# Altium project Copy of MB1248.PrjPCB (part 2 of 3)

## Sheet Audio.SchDoc: Audio
size A4; Project: STM32H7-DK; Date: Not used; ApprovedBy: Not used; CheckedBy: Not used; Author: Not used; CompanyName: STMicroelectronics; DrawnBy: Not used; Engineer: Not used; Organization: Not used; Address1: Not used; Address2: Not used; Address3: Not used; Address4: Not used; DocumentNumber: Not used; Revision: Not used; SheetNumber: 6; SheetTotal: 16; CurrentTime: Not used; CurrentDate: Not used; Time: Not used; DocumentFullPathAndName: Not used; DocumentName: Not used; ModifiedDate: Not used; ImagePath: Not used; ProjectName: Not used; Application_BuildNumber: Not used
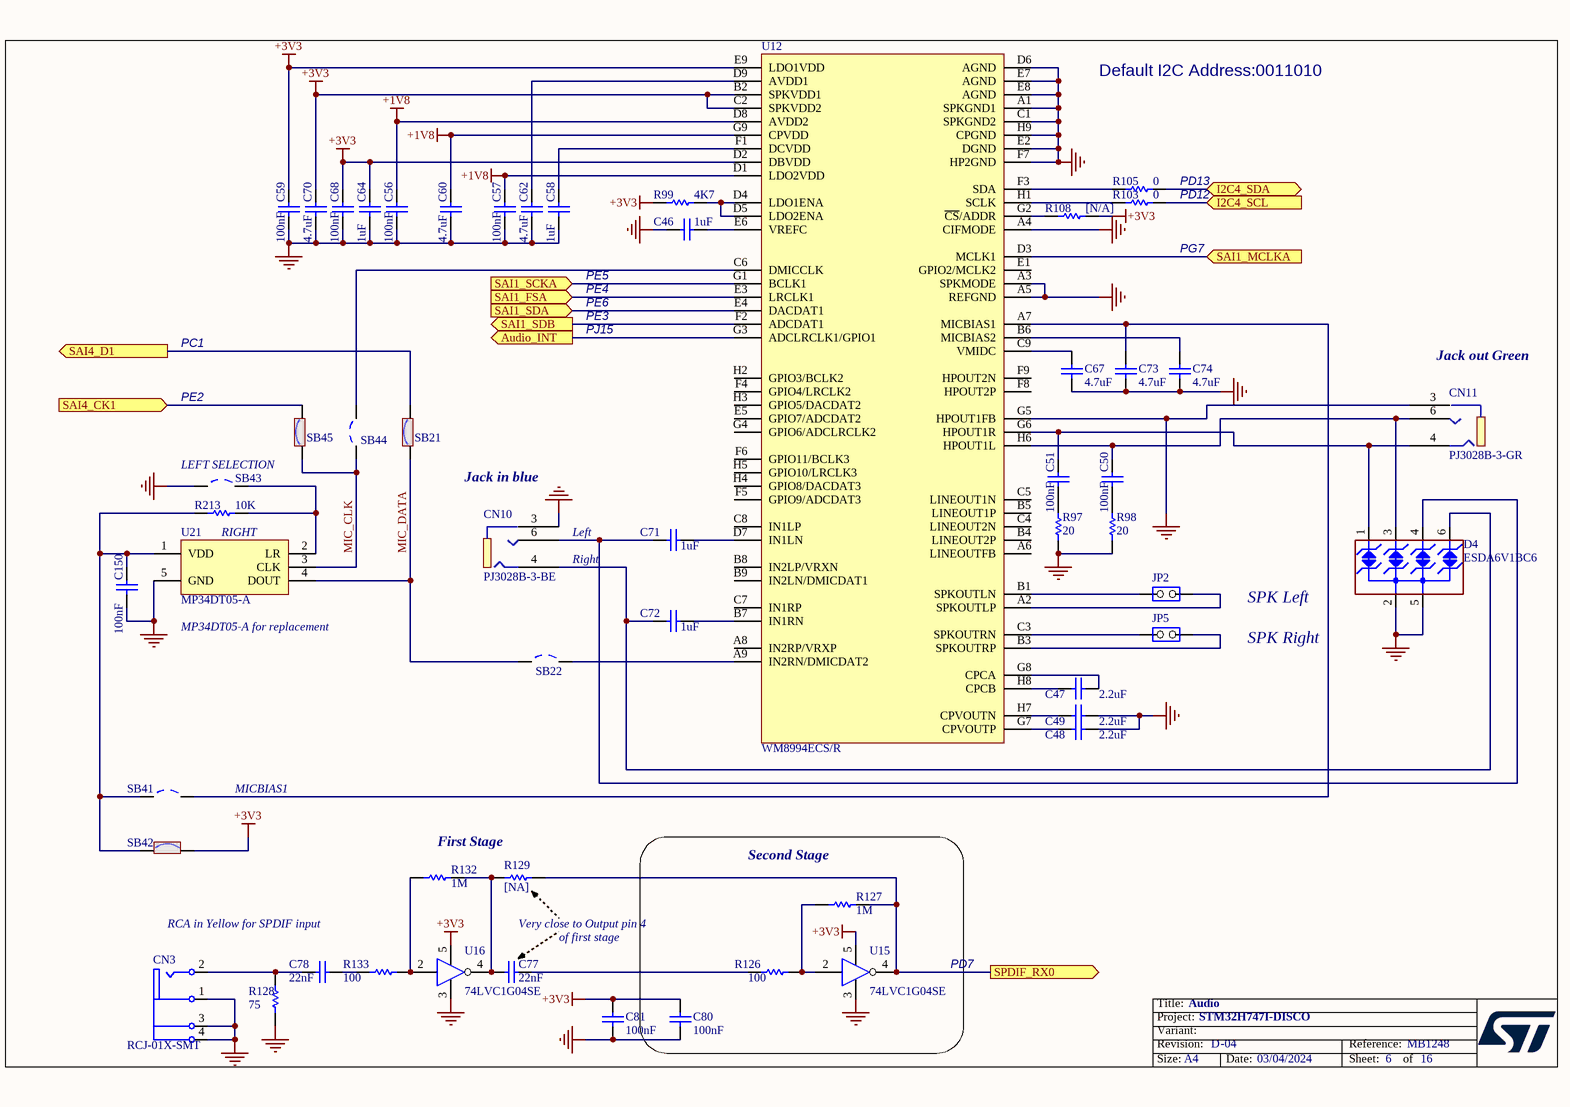
[diagram p5: Audio.SchDoc]

### Parts
C46  1uF  [0603C]
C47  2.2uF  [0603C]
C48  2.2uF  [0603C]
C49  2.2uF  [0603C]
C50  100nF  [0603C]
C51  100nF  [0603C]
C56  100nF  [0603C]
C57  100nF  [0603C]
C58  1uF  [0603C]
C59  100nF  [0603C]
C60  4.7uF  [0603C]
C62  4.7uF  [0603C]
C64  1uF  [0603C]
C67  4.7uF  [0603C]
C68  100nF  [0603C]
C70  4.7uF  [0603C]
C71  1uF  [0603C]
C72  1uF  [0603C]
C73  4.7uF  [0603C]
C74  4.7uF  [0603C]
C77  22nF  [0603C]
C78  22nF  [0603C]
C80  100nF  [0603C]
C81  100nF  [0603C]
C150  100nF  [0603C]
CN3  RCJ-01X-SMT  [RCA_3SM_1TH_14X15]
CN10  PJ3028B-3-BE  [PJ3028B]
CN11  PJ3028B-3-GR  [PJ3028B]
D4  ESDA6V1BC6  [SOT23-6L]
JP2  (no value)  [SIP2]
JP5  (no value)  [SIP2]
R97  20  [0603R]
R98  20  [0603R]
R99  4K7  [0603R]
R103  0  [0603R]
R105  0  [0603R]
R108  [N/A]  [0603R]
R126  100  [0603R]
R127  1M  [0603R]
R128  75  [0603R]
R129  [NA]  [0603R]
R132  1M  [0603R]
R133  100  [0603R]
R213  10K  [0603R]
SB21  Solder Bridge ON  [SB_0603]  (value not drawn)
SB22  Solder Bridge OFF  [SB_0603]  (value not drawn)
SB41  Solder Bridge OFF  [SB_0603]  (value not drawn)
SB42  Solder Bridge ON  [SB_0603]  (value not drawn)
SB43  Solder Bridge OFF  [SB_0603]  (value not drawn)
SB44  Solder Bridge OFF  [SB_0603]  (value not drawn)
SB45  Solder Bridge ON  [SB_0603]  (value not drawn)
U12  WM8994ECS/R  [BGA72_0R5_4R5X4]
U15  74LVC1G04SE  [SOT-353]
U16  74LVC1G04SE  [SOT-353]
U21  MP34DT05-A  [MP34DT01TR]

### Blocks framed on the sheet
Second Stage: C80 R126 R127 U15

### Ports
Audio_INT (out), I2C4_SCL (in), I2C4_SDA (bidir), SAI1_FSA (in), SAI1_MCLKA (in), SAI1_SCKA (in), SAI1_SDA (in), SAI1_SDB (out), SAI4_CK1 (in), SAI4_D1 (out), SPDIF_RX0 (out)

### Nets
+1V8: C56.1 C57.1 C60.1 U12.D1(LDO2VDD) U12.D8(AVDD2) U12.G9(CPVDD)
+3V3: C59.1 C64.1 C68.1 C70.1 C80.2 C81.2 R99.2 R108.2 SB42.2 U12.B2(SPKVDD1) U12.C2(SPKVDD2) U12.D2(DBVDD) U12.E9(LDO1VDD) U15.5(VCC) U16.5(VCC)
GND: C46.2 C48.2 C49.2 C56.2 C57.2 C58.2 C59.2 C60.2 C62.2 C64.2 C67.1 C68.2 C70.2 C73.1 C74.1 C80.1 C81.1 C150.2 CN3.1(Ground) CN3.3(Ground) CN3.4(Ground) CN10.3 CN11.3 D4.2(IO2) D4.5(IO4) R97.2 R98.2 R128.1 SB43.1 U12.A1(SPKGND1) U12.A3(SPKMODE) U12.A4(CIFMODE) U12.A5(REFGND) U12.C1(SPKGND2) U12.D6(AGND) U12.E2(DGND) U12.E7(AGND) U12.E8(AGND) U12.F7(HP2GND) U12.G5(HPOUT1FB) U12.H9(CPGND) U15.3(GND) U16.3(GND) U21.5(GND)
MIC_CLK: SB44.1 SB45.1 U21.3(CLK)
MIC_DATA: SB21.1 SB22.1 U21.4(DOUT)
PC1: SB21.2 ; port SAI4_D1
PD7: R127.2 R129.2 U15.4(Y) ; port SPDIF_RX0
PD12: R103.1 ; port I2C4_SCL
PD13: R105.1 ; port I2C4_SDA
PE3: U12.F2(ADCDAT1) ; port SAI1_SDB
PE4: U12.E3(LRCLK1) ; port SAI1_FSA
PE5: U12.G1(BCLK1) ; port SAI1_SCKA
PE6: U12.E4(DACDAT1) ; port SAI1_SDA
PG7: U12.D3(MCLK1) ; port SAI1_MCLKA
PJ15: U12.G3(ADCLRCLK1/GPIO1) ; port Audio_INT
NetC46_1: C46.1 U12.E6(VREFC)
NetC47_1: C47.1 U12.H8(CPCB)
NetC47_2: C47.2 U12.G8(CPCA)
NetC48_1: C48.1 U12.G7(CPVOUTP)
NetC49_1: C49.1 U12.H7(CPVOUTN)
NetC50_1: C50.1 CN11.6 D4.3(GND) U12.H6(HPOUT1L)
NetC50_2: C50.2 R98.1
NetC51_1: C51.1 CN11.4 D4.1(IO1) U12.G6(HPOUT1R)
NetC51_2: C51.2 R97.1
NetC58_1: C58.1 U12.F1(DCVDD)
NetC62_1: C62.1 U12.D9(AVDD1)
NetC67_2: C67.2 U12.C9(VMIDC)
NetC71_1: C71.1 U12.D7(IN1LN)
NetC71_2: C71.2 CN10.6 D4.4(IO3)
NetC72_1: C72.1 U12.B7(IN1RN)
NetC72_2: C72.2 CN10.4 D4.6(NC)
NetC73_2: C73.2 SB41.2 U12.A7(MICBIAS1)
NetC74_2: C74.2 U12.B6(MICBIAS2)
NetC77_1: C77.1 R129.1 R132.2 U16.4(Y)
NetC77_2: C77.2 R126.1
NetC78_1: C78.1 CN3.2(Signal) R128.2
NetC78_2: C78.2 R133.1
NetC150_1: C150.1 R213.2 SB41.1 SB42.1 U21.1(VDD)
NetJP2_1: JP2.1(COMMON) U12.A2(SPKOUTLP)
NetJP2_2: JP2.2(NO) U12.B1(SPKOUTLN)
NetJP5_1: JP5.1(COMMON) U12.B3(SPKOUTRP)
NetJP5_2: JP5.2(NO) U12.C3(SPKOUTRN)
NetR87_1: SB45.2 ; port SAI4_CK1
NetR99_1: R99.1 U12.D4(LDO1ENA) U12.D5(LDO2ENA)
NetR103_2: R103.2 U12.H1(SCLK)
NetR105_2: R105.2 U12.F3(SDA)
NetR108_1: R108.1 U12.G2(~{CS}/ADDR)
NetR126_2: R126.2 R127.1 U15.2(A)
NetR132_1: R132.1 R133.2 U16.2(A)
NetR213_1: R213.1 SB43.2 U21.2(LR)
NetSB22_2: SB22.2 U12.A9(IN2RN/DMICDAT2)
NetSB44_2: SB44.2 U12.C6(DMICCLK)

Not connected (* = marked no-connect by the designer): U12 A6(LINEOUTFB) A8(IN2RP/VRXP) B4(LINEOUT2P) B5(LINEOUT1P) B8(IN2LP/VRXN) B9(IN2LN/DMICDAT1) C4(LINEOUT2N) C5(LINEOUT1N) C7(IN1RP) C8(IN1LP) E1(GPIO2/MCLK2) E5(GPIO7/ADCDAT2) F4(GPIO4/LRCLK2) F5(GPIO9/ADCDAT3) F6(GPIO11/BCLK3) F8(HPOUT2P) F9(HPOUT2N) G4(GPIO6/ADCLRCLK2) H2(GPIO3/BCLK2) H3(GPIO5/DACDAT2) H4(GPIO8/DACDAT3) H5(GPIO10/LRCLK3); U15 1(NC); U16 1(NC)

### Notes on the sheet
- Default I2C Address:0011010
- PD13
- PD12
- PE5
- PG7
- PC1
- PE6
- PE4
- PE3
- PJ15
- PE2
- (near CN11) Jack out Green
- (near SB43) LEFT SELECTION
- Jack in blue
- RIGHT
- Left
- Right
- SPK Left
- MP34DT05-A for replacement
- SPK Right
- MICBIAS1
- First Stage
- RCA in Yellow for SPDIF input
- Very close to Output pin 4
- of first stage
- PD7
- Title:
- Project:
- Size:
- Revision:
- Variant:
- A4
- -
- Date:
- Reference:
- Sheet:
- of

### Library data of the parts
C46-C49 C58 C64 = CAP: Capacitor; Value: 100nF; Published: 8-Jun-2000; Revision: July-2002: Re-released for DXP Platform.; Publisher: Altium Limited
C50 C51 C56 C57 C59 C60 C62 C67 C68 C70 C73 C74 C150 = Cap: Capacitor; Value: 10nF; Published: 8-Jun-2000; Revision: July-2002: Re-released for DXP Platform.; Publisher: Altium Limited
C71 C72 = Cap_1uF_X5R_10%_0603: Capacitor,1uF,16V,X5R,10%,0603,YAGEO; Manuf_Part_1: CC0603KRX5R7BB105; Revision: July-2002: Re-released for DXP Platform.; Value: 1uF; Order: CC0603KRX5R7BB105; Manuf_1: YAGEO; ECCN_US/EU: n/a
C77 C78 = Cap_22nF_X7R_10%_0402: Capacitor,22nF,16V,X7R,10%,0402,YAGEO; Revision: July-2002: Re-released for DXP Platform.; Value: 22nF; Manuf_1: YAGEO; ECCN_US/EU: n/a
C80 C81 = CAP: Capacitor; Published: 8-Jun-2000; Revision: July-2002: Re-released for DXP Platform.; Publisher: Altium Limited; Value: 100nF
CN3 = RCA_SMD: RCA Phono Jack, Right Angle, SMD, Yellow; Manuf_Part_1: JBB0819100002; Manuf_1: JIUBABA; Manuf_2: CUI Inc; Manuf_Part_2: RCJ-014-SMT; Distrib: Sub Co
CN10 = PJ3028B-3-TR: Connector Jack Stereo 3.5mm, female SMT, Blue (Line input); Manuf_Part_1: PJ3028B-3_BE; Manuf_Part_2: PJ30280-3_BE; ECCN_US/EU: n/a; Manuf_1: http://ww.qiaod.com
CN11 = PJ3028B-3-TR: Connector Jack Stereo 3.5mm, female SMT, Green (Line input); Manuf_Part_1: PJ3028B-3_GR; Manuf_Part_2: PJ30280-3_GR; ECCN_US/EU: n/a; Manuf_1: http://ww.qiaod.com
D4 = ESDA6V1BC6: 4-line ESD protection; Manuf_1: STM; Ref St: 9179034; Fitted: YES; ECCN_US/EU: EAR99/NEC; Manuf_Part_1: ESDA6V1BC6; Distrib: ST; Order: ESDA6V1BC6; Ordered by: STM
JP2 JP5 = JP2
R97-R99 R103 R105 R213 = Res1: Resistor; Value: 1K; Published: 8-Jun-2000; Revision: July-2002: Re-released for DXP Platform.; Publisher: Altium Limited
R108 = res1: Resistor; Value: 1K; Ordered by: Subcon; ECCN_US/EU: NA; Fitted: NO; Published: 8-Jun-2000; Revision: July-2002: Re-released for DXP Platform.; Publisher: Altium Limited
R126 = Res_100_1%_0402: Resistor,100,0402,1%,YAGEO; Value: 100; Manuf_1: YAGEO; ECCN_US/EU: n/a; Distrib: FARNELL
R127 R132 = res1: Resistor, 1M , 0603; Ordered by: Subcon; ECCN_US/EU: NA; Published: 8-Jun-2000; Revision: July-2002: Re-released for DXP Platform.; Publisher: Altium Limited; Value: 1M
R128 = Res_75_1%_0402: Resistor,75,0402,1%,YAGEO; Order: 311-75.0LRTR-ND; Value: 75; Manuf_1: YAGEO; ECCN_US/EU: n/a; Distrib: DIGIKEY
R129 = Res_NA_0402: Resistor,[NA],0402; Fitted: NO; Value: [NA]; ECCN_US/EU: n/a
R133 = Res_100_1%_0402: Resistor,100,0402,1%,YAGEO; Order: 9239111; Value: 100; Manuf_1: YAGEO; ECCN_US/EU: n/a; Distrib: FARNELL
SB21 SB42 SB45 = SB_ON: Fitted: YES; Ordered by: Subcon; Revision: July-2002: Re-released for DXP Platform.; ECCN_US/EU: n/a
SB22 SB41 SB43 SB44 = SB_OFF: Fitted: NO; Ordered by: Subcon; Revision: July-2002: Re-released for DXP Platform.; ECCN_US/EU: n/a
U12 = WM8994ECS/R: Manuf_1: Wolfson; Ordered by: Subcon; ECCN_US/EU: EAR99/NEC; Fitted: YES; Manuf_Part_1: WM8994ECS/R
U15 U16 = 74LVC1G04SE: Single inverter gate with a standard push-pull output. (1.65V to 5.5V); Manuf_Part_1: 74LVC1G04SE-7; Manuf_1: DIODES; Ordered by: Subcon; Fitted: YES; ECCN_US/EU: EAR99/NEC; Distrib: FARNELL
U21 = MP34DT01TR: MEMS audio sensor; Ordered by: STM; ECCN_US/EU: EAR99/NEC; Fitted: YES; Revision: 17-Jul-2002: Re-released for DXP Platform.; Publisher: Altium Limited; Manuf_1: STM; Manuf_Part_1: MP34DT05-A

## Sheet Ethernet.SchDoc: Ethernet
size A4; Project: STM32H7-DK; Date: Not used; ApprovedBy: Not used; CheckedBy: Not used; Author: Not used; CompanyName: STMicroelectronics; DrawnBy: Not used; Engineer: Not used; Organization: Not used; Address1: Not used; Address2: Not used; Address3: Not used; Address4: Not used; DocumentNumber: Not used; Revision: Not used; SheetNumber: 8; SheetTotal: 16; CurrentTime: Not used; CurrentDate: Not used; Time: Not used; DocumentFullPathAndName: Not used; DocumentName: Not used; ModifiedDate: Not used; ImagePath: Not used; ProjectName: Not used; Application_BuildNumber: Not used
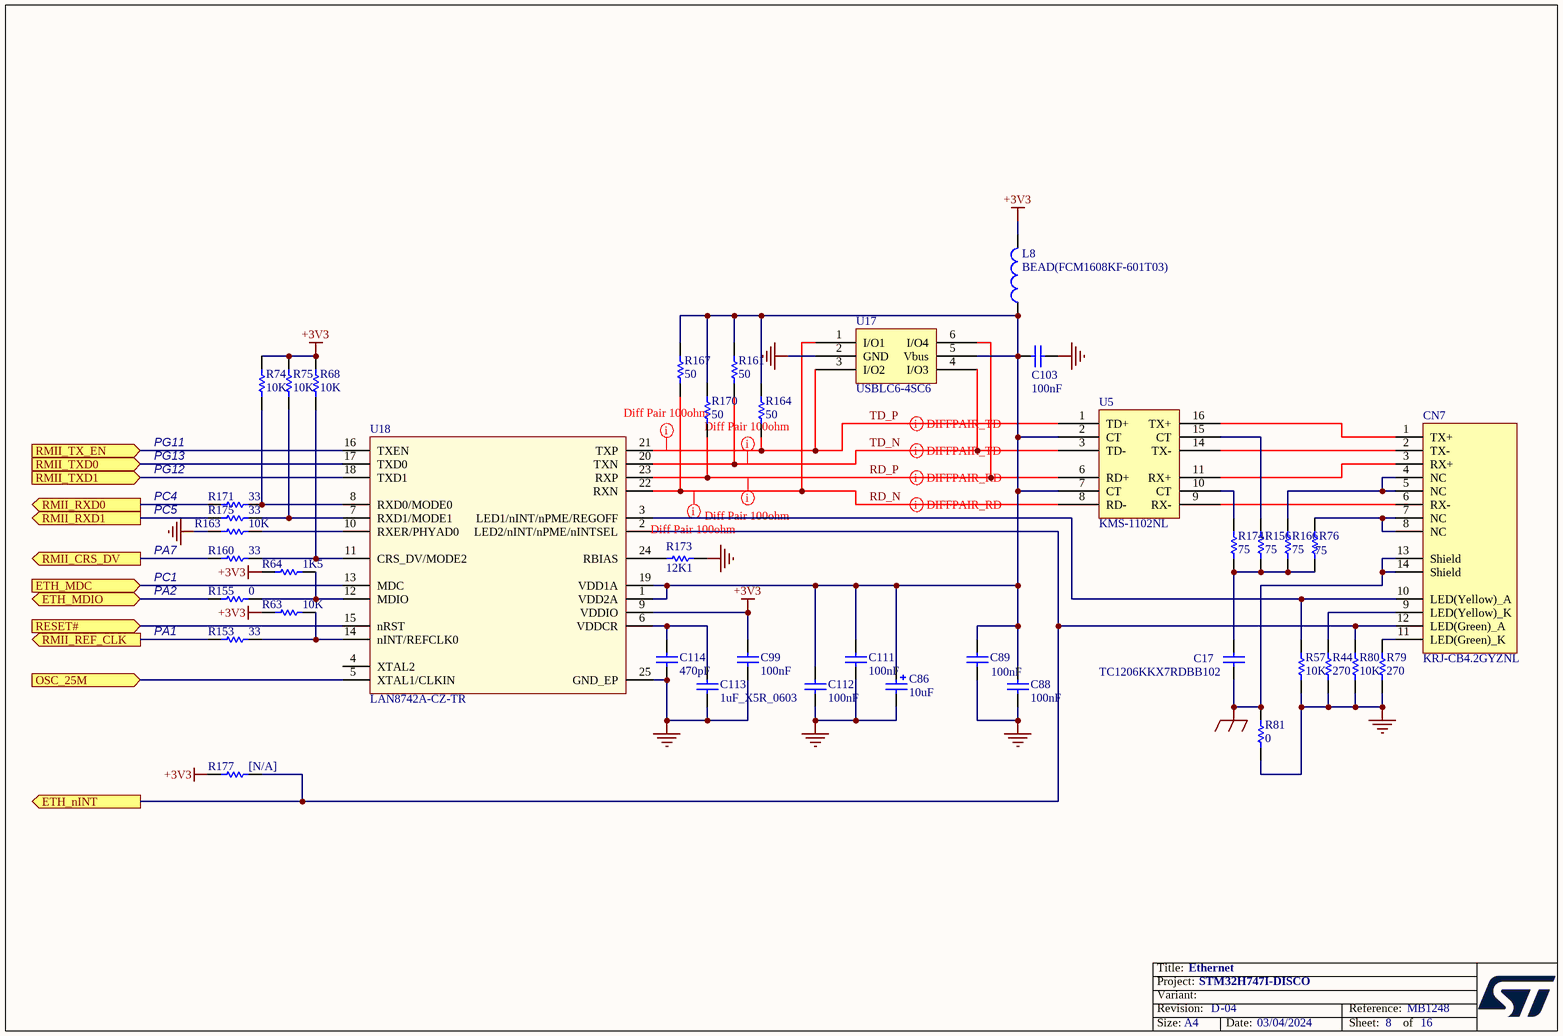
[diagram p6: Ethernet.SchDoc]

### Parts
C17  TC1206KKX7RDBB102  [1206C]
C86  10uF  [TAN-A]
C88  100nF  [0603C]
C89  100nF  [0603C]
C99  100nF  [0603C]
C103  100nF  [0603C]
C111  100nF  [0603C]
C112  100nF  [0603C]
C113  1uF_X5R_0603  [0603C]
C114  470pF  [0603C]
CN7  KRJ-CB4.2GYZNL  [RJ45_LED_KRJ-CB4R2GYZNL_EM]
L8  BEAD(FCM1608KF-601T03)  [0603L]
R44  270  [0603R]
R57  10K  [0603R]
R63  10K  [0603R]
R64  1K5  [0603R]
R68  10K  [0603R]
R74  10K  [0603R]
R75  10K  [0603R]
R76  75  [0603R]
R79  270  [0603R]
R80  10K  [0603R]
R81  0  [0805R]
R153  33  [0603R]
R155  0  [0603R]
R156  75  [0603R]
R160  33  [0603R]
R161  50  [0603R]
R163  10K  [0603R]
R164  50  [0603R]
R166  75  [0603R]
R167  50  [0603R]
R170  50  [0603R]
R171  33  [0603R]
R173  12K1  [0603R]
R174  75  [0603R]
R175  33  [0603R]
R177  [N/A]  [0603R]
U5  KMS-1102NL  [TF_16SM_12R7X9R65]
U17  USBLC6-4SC6  [SOT23-6]
U18  LAN8742A-CZ-TR  [QFN24_0R5_4X4]

### Ports
ETH_MDC (in), ETH_MDIO (bidir), ETH_nINT (out), OSC_25M (in), RESET# (in), RMII_CRS_DV (out), RMII_REF_CLK (out), RMII_RXD0 (out), RMII_RXD1 (out), RMII_TX_EN (in), RMII_TXD0 (in), RMII_TXD1 (in)

### Nets
+3V3: C99.2 L8.2 R63.1 R64.2 R68.1 R74.1 R75.1 R177.1 U18.9(VDDIO)
EGND: C17.1 CN7.13(Shield) CN7.14(Shield) R81.1
GND: C86.2 C88.1 C89.1 C99.1 C103.1 C111.1 C112.1 C113.2 C114.1 R44.2 R57.2 R79.2 R80.2 R81.2 R163.2 R173.2 U17.2(GND) U18.25(GND_EP)
PA1: R153.2 ; port RMII_REF_CLK
PA2: R155.2 ; port ETH_MDIO
PA7: R160.2 ; port RMII_CRS_DV
PC4: R171.2 ; port RMII_RXD0
PC5: R175.2 ; port RMII_RXD1
PG11: U18.16(TXEN) ; port RMII_TX_EN
PG12: U18.18(TXD1) ; port RMII_TXD1
PG13: U18.17(TXD0) ; port RMII_TXD0
RD_N: R167.1 U5.8(RD-) U17.1(I/O1) U18.22(RXN)
RD_P: R170.1 U5.6(RD+) U17.6(I/O4) U18.23(RXP)
TD_N: R161.1 U5.3(TD-) U17.4(I/O3) U18.20(TXN)
TD_P: R164.1 U5.1(TD+) U17.3(I/O2) U18.21(TXP)
NetB1_2: U18.15(nRST) ; port RESET#
NetC17_2: C17.2 R76.1 R156.1 R166.1 R174.1
NetC86_1: C86.1 C88.2 C89.2 C103.2 C111.2 C112.2 L8.1 R161.2 R164.2 R167.2 R170.2 U5.2(CT) U5.7(CT) U17.5(Vbus) U18.1(VDD2A) U18.19(VDD1A)
NetC113_1: C113.1 C114.2 U18.6(VDDCR)
NetCN7_1: CN7.1(TX+) U5.16(TX+)
NetCN7_2: CN7.2(TX-) U5.14(TX-)
NetCN7_3: CN7.3(RX+) U5.11(RX+)
NetCN7_4: CN7.4(NC) CN7.5(NC) R166.2
NetCN7_6: CN7.6(RX-) U5.9(RX-)
NetCN7_7: CN7.7(NC) CN7.8(NC) R76.2
NetCN7_9: CN7.9(LED(Yellow)_K) R44.1
NetCN7_10: CN7.10(LED(Yellow)_A) R57.1 U18.3(LED1/nINT/nPME/REGOFF)
NetCN7_11: CN7.11(LED(Green)_K) R79.1
NetCN7_12: CN7.12(LED(Green)_A) R80.1 R177.2 U18.2(LED2/nINT/nPME/nINTSEL) ; port ETH_nINT
NetR63_2: R63.2 R153.1 U18.14(nINT/REFCLK0)
NetR64_1: R64.1 R155.1 U18.12(MDIO)
NetR68_2: R68.2 R160.1 U18.11(CRS_DV/MODE2)
NetR72_2: U18.5(XTAL1/CLKIN) ; port OSC_25M
NetR74_2: R74.2 R171.1 U18.8(RXD0/MODE0)
NetR75_2: R75.2 R175.1 U18.7(RXD1/MODE1)
NetR156_2: R156.2 U5.15(CT)
NetR163_1: R163.1 U18.10(RXER/PHYAD0)
NetR173_1: R173.1 U18.24(RBIAS)
NetR174_2: R174.2 U5.10(CT)
NetSB8_1: U18.13(MDC) ; port ETH_MDC

Not connected (* = marked no-connect by the designer): U18 4(XTAL2)

### Layout directives
differential pair: RD_N, RD_P, TD_N, TD_P
rule Matched Net Lengths [Tolerance = 100mil]: RD_N, RD_P, TD_N, TD_P

### Notes on the sheet
- PG11
- PG13
- PG12
- PC4
- PC5
- PA7
- PC1
- PA2
- PA1
- Title:
- Project:
- Size:
- Revision:
- Variant:
- A4
- -
- Date:
- Reference:
- Sheet:
- of

### Library data of the parts
C17 = Capacitor_ST: Capacitor 0402 / 0603 / 0805/ 1206; Value: 100nF; Revision: July-2002: Re-released for DXP Platform.
C86 = Cap_10uF_POL_10%_TANA: Polarized Capacitor,10uF,10V,10%,typeA,VISHAY; Manuf_Part_1: 293D106X9010A2TE3; Revision: July-2002: Re-released for DXP Platform.; Value: 10uF; Manuf_1: VISHAY; Order: *; ECCN_US/EU: n/a
C88 C89 C99 C103 C111 C112 = Capacitor_ST: Capacitor 0402 / 0603 / 0805; Revision: July-2002: Re-released for DXP Platform.; Value: 100nF
C113 = CAP SMD 0603  X5R 1礔 25V 10%: 0603  X5R 1礔; Rated voltage: 25V; Tolerance: 10%; Manufacturer: *; Manufacturer P/N: *; Order code Farnell: 1288202RL; Value: 1礔; Power: *; Technology: X5R; Temperature  Factor: *; Temperature Max: +125癈; Temperature Min: -55癈; STS Code: *
C114 = Capacitor_ST: Capacitor 0402 / 0603 / 0805; Value: 100nF; Revision: July-2002: Re-released for DXP Platform.
CN7 = KRJ-CB4.2GYZNL: 100 Base-TX (Fast Ethernet) SMD RJ45 single port (1x1) with LEDS Integrated Magnetics Connector; Manuf_1: DGKYD; ECCN_US/EU: EAR99/NEC; Ordered by: Subcon; Fitted: YES; Manuf_Part_1: KRJ-CB4.2GYZNL
L8 = Inductor: Value: 100uH; Published: 8-Jun-2000; Revision: July-2002: Re-released for DXP Platform.; Publisher: Altium Limited
R44 R79 = Resistor_ST: Resistor 0402 / 0603 / 0805; Value: 10K
R57 R63 R68 R74 R75 R80 R163 = Resistor_ST: Resistor 0402 / 0603 / 0805; Value: 10K
R64 = Res_1K5_1%_0402: Resistor,1K5,0402,1%,YAGEO; Value: 1K5; Manuf_1: YAGEO; ECCN_US/EU: n/a; Distrib: FARNELL
R76 R81 R156 R166 R174 = Res_75_1%_0603: Resistor,75,0603,1%,YAGEO; Manuf_1: YAGEO; Order: *; ECCN_US/EU: n/a; Distrib: FARNELL
  R76 R156 R166 R174: Value: 75
  R81: Value: 0
R153 R160 R171 R175 = Res_33_1%_0402: Resistor,33,0402,1%,YAGEO; Value: 33; Manuf_1: YAGEO; Order: *; ECCN_US/EU: n/a; Distrib: FARNELL
R155 = Res1: Resistor; Value: 1K; Published: 8-Jun-2000; Revision: July-2002: Re-released for DXP Platform.; Publisher: Altium Limited
R161 R164 R167 R170 = Res_50_1%_0603: Resistor,50,0603,1%,YAGEO; Value: 50; Manuf_1: YAGEO; Order: *; ECCN_US/EU: n/a; Distrib: FARNELL
R173 = Res_12K1_1%_0603: Resistor,12K1,0603,1%,VISHAY; Manuf_Part_1: MCT 0603-50 1% P5 12K1; Order: 2325243; Value: 12K1; ECCN_US/EU: n/a; Manuf_1: VISHAY; Distrib: FARNELL
R177 = res1: as R108 on sheet Audio; Published: 8-Jun-2000; Revision: July-2002: Re-released for DXP Platform.; Publisher: Altium Limited
U5 = KMS-1102NL: Manuf_1: DGKYD; Fitted: YES; Ordered by: Subcon; ECCN_US/EU: NA; Manuf_Part_1: KMS-1102NL
U17 = USBLC6-4SC6: Fitted: YES; Ordered by: STM; ECCN_US/EU: EAR99/NEC; Manuf_1: STM; Manuf_Part_1: USBLC6-4SC6
U18 = LAN8742A-CZ-TR: LAN8742A-CZ-TR - Small Footprint RMII 10/100 Ethernet, Transceiver with HP Auto-MDIX and flexPWR Technology SQFN-24; Manuf_1: MICROCHIP; Ordered by: Subcon; Fitted: YES; ECCN_US/EU: EAR99/NEC; Manuf_Part_1: LAN8742A-CZ-TR

## Sheet Peripherals.SchDoc: Peripherals
size A4; Project: STM32H7-DK; Date: Not used; ApprovedBy: Not used; CheckedBy: Not used; Author: Not used; CompanyName: STMicroelectronics; DrawnBy: Not used; Engineer: Not used; Organization: Not used; Address1: Not used; Address2: Not used; Address3: Not used; Address4: Not used; DocumentNumber: Not used; Revision: Not used; SheetNumber: 10; SheetTotal: 16; CurrentTime: Not used; CurrentDate: Not used; Time: Not used; DocumentFullPathAndName: Not used; DocumentName: Not used; ModifiedDate: Not used; ImagePath: Not used; ProjectName: Not used; Application_BuildNumber: Not used
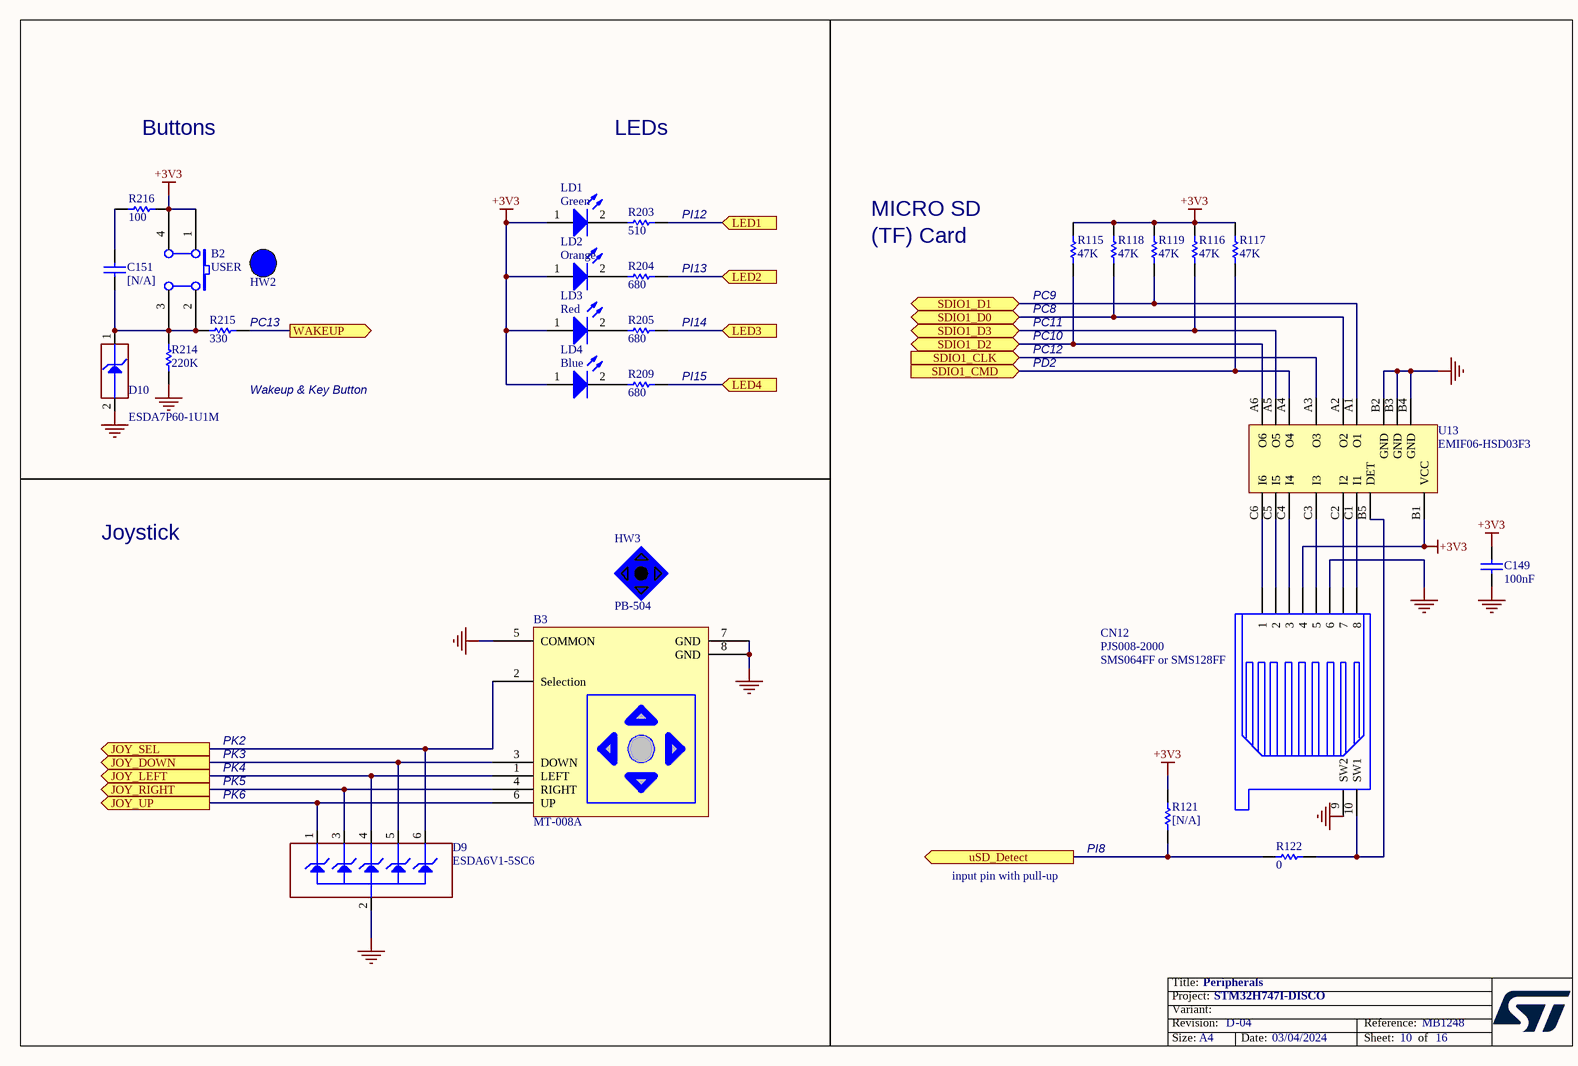
[diagram p7: Peripherals.SchDoc]

### Parts
B2  USER  [PB10]
B3  MT-008A  [MT-008A]
C149  100nF  [0603C]
C151  [N/A]  [0603C]
CN12  PJS008-2000  [MSD_PJS008_]
D9  ESDA6V1-5SC6  [SOT23-6L]
D10  ESDA7P60-1U1M  [DO_2SM_1R6X1_21]
HW2  BUTTON_HAT_BLUE  (value not drawn)  (mechanical)
HW3  value PB-504  (hidden comment: JOYSTICK_BLUE_HAT)  (mechanical)
LD1  Green  [0603D]
LD2  Orange  [0603D]
LD3  Red  [0603D]
LD4  Blue  [0603D]
R115  47K  [0603R]
R116  47K  [0603R]
R117  47K  [0603R]
R118  47K  [0603R]
R119  47K  [0603R]
R121  [N/A]  [0603R]
R122  0  [0603R]
R203  510  [0603R]
R204  680  [0603R]
R205  680  [0603R]
R209  680  [0603R]
R214  220K  [0603R]
R215  330  [0603R]
R216  100  [0603R]
U13  EMIF06-HSD03F3  [FBGA17_0R4_1R1X2R4]

### Ports
JOY_DOWN (out), JOY_LEFT (out), JOY_RIGHT (out), JOY_SEL (out), JOY_UP (out), LED1 (in), LED2 (in), LED3 (in), LED4 (in), SDIO1_CLK (in), SDIO1_CMD (in), SDIO1_D0 (bidir), SDIO1_D1 (bidir), SDIO1_D2 (bidir), SDIO1_D3 (bidir), uSD_Detect (out), WAKEUP (out)

### Nets
+3V3: B2.1(A0) B2.4(A1) C149.1 CN12.4 LD1.1(A) LD2.1(A) LD3.1(A) LD4.1(A) R115.1 R116.1 R117.1 R118.1 R119.1 R121.2 R216.1 U13.B1(VCC)
GND: B3.5(COMMON) B3.7(GND) B3.8(GND) C149.2 CN12.6 CN12.9(SW2) D9.2(GND) D10.2(GND) R214.2 U13.B2(GND) U13.B3(GND) U13.B4(GND)
DCMI_D3: R119.2 U13.A1(O1) ; port SDIO1_D1
DCMI_D4: R116.2 U13.A5(O5) ; port SDIO1_D3
PC8: R118.2 U13.A2(O2) ; port SDIO1_D0
PC10: R115.2 U13.A6(O6) ; port SDIO1_D2
PC12: U13.A3(O3) ; port SDIO1_CLK
PC13: R215.2 ; port WAKEUP
PD2: R117.2 U13.A4(O4) ; port SDIO1_CMD
PI8: R121.1 R122.1 ; port uSD_Detect
PI12: R203.1 ; port LED1
PI13: R204.1 ; port LED2
PI14: R205.1 ; port LED3
PI15: R209.1 ; port LED4
PK2: B3.2(Selection) D9.6(IO5) ; port JOY_SEL
PK3: B3.3(DOWN) D9.5(IO4) ; port JOY_DOWN
PK4: B3.1(LEFT) D9.4(IO3) ; port JOY_LEFT
PK5: B3.4(RIGHT) D9.3(IO2) ; port JOY_RIGHT
PK6: B3.6(UP) D9.1(IO1) ; port JOY_UP
NetB2_2: B2.2(B0) B2.3(B1) C151.1 D10.1(IO1) R214.1 R215.1
NetC151_2: C151.2 R216.2
NetCN12_1: CN12.1 U13.C6(I6)
NetCN12_2: CN12.2 U13.C5(I5)
NetCN12_3: CN12.3 U13.C4(I4)
NetCN12_5: CN12.5 U13.C3(I3)
NetCN12_7: CN12.7 U13.C2(I2)
NetCN12_8: CN12.8 U13.C1(I1)
NetCN12_10: CN12.10(SW1) R122.2 U13.B5(DET)
NetLD1_2: LD1.2(K) R203.2
NetLD2_2: LD2.2(K) R204.2
NetLD3_2: LD3.2(K) R205.2
NetLD4_2: LD4.2(K) R209.2

### Notes on the sheet
- Buttons
- LEDs
- (near R203) PI12
- MICRO SD
- (TF) Card
- (near R215) PC13
- (near R204) PI13
- (near R205) PI14
- (near R115) PC8
- (near R115) PC9
- PC11
- Wakeup & Key Button
- (near R209) PI15
- PC10
- PC12
- PD2
- Joystick
- (near CN12) SMS064FF or SMS128FF
- PK2
- PK3
- PK4
- PK5
- PK6
- PI8
- input pin with pull-up
- Title:
- Project:
- Size:
- Revision:
- Variant:
- A4
- -
- Date:
- Reference:
- Sheet:
- of

### Library data of the parts
B2 = SW PUSHBUTTON: SE PUSHBUTTON
C149 = CAP: Capacitor; Published: 8-Jun-2000; Revision: July-2002: Re-released for DXP Platform.; Publisher: Altium Limited; Value: 100nF
C151 = cap: Capacitor; Value: 100nF; Ordered by: Subcon; ECCN_US/EU: NA; Fitted: NO; Published: 8-Jun-2000; Revision: July-2002: Re-released for DXP Platform.; Publisher: Altium Limited
CN12 = SMS016AFA5E
D9 = ESDA6V1-5SC6: 5-line ESD protection; Manuf_1: STM; Fitted: YES; ECCN_US/EU: EAR99/NEC; Manuf_Part_1: ESDA6V1-5SC6; Distrib: ST; Order: ESDA6V1-5SC6; Ordered by: STM
D10 = ESDALC6V1-1U2: Dual Transil array for ESD protection; Manuf_1: STM; Ref St: .; ECCN_US/EU: EAR99/NEC; Fitted: YES; Provided: ST; Manuf_Part_1: ESDA7P60-1U1M; Distrib: ST; Ordered by: STM; Order: ESDA7P60-1U1M
HW3 = MCD-01337: Joystick, Blue hat; Part_Type: Misc; Part_Preference: Alternate; Manufacturer: JIUBABA; Component_Country_Of_Origin: Unknown; Alternate_EMS: A; ShowFields: YES; ID: 3437; Internal_Part_Number: MCD-01337; Status: Released; Manufacturer_Part_Number: PB-504; Package: 8.9x8.9mm; ComponentLink1URL: http://tunmcdsvn.tun.st.com/Component_Documentation_Library/Trunk/Misc/JIUBABA_PB-504; Order_Code_Digikey: N/A; Order_Code_Farnell: N/A; Order_Code_RS: N/A; Manufacturer_HQ_COO: Unknown
LD1-LD4 = LED2: Typical RED, GREEN, YELLOW, AMBER GaAs LED; Published: 8-Jun-2000; Revision: July-2002: Re-released for DXP Platform.; Publisher: Altium Limited
R115-R119 R214 = res1: Resistor; Value: 1K; Published: 8-Jun-2000; Revision: July-2002: Re-released for DXP Platform.; Publisher: Altium Limited
R121 = res1: Resistor; Value: 10K; Ordered by: Subcon; ECCN_US/EU: NA; Fitted: NO; Published: 8-Jun-2000; Revision: July-2002: Re-released for DXP Platform.; Publisher: Altium Limited
R122 R203-R205 R209 R215 R216 = Res1: Resistor; Value: 1K; Published: 8-Jun-2000; Revision: July-2002: Re-released for DXP Platform.; Publisher: Altium Limited
U13 = EMIF06-HSD03F3: EMI filter with integrated ESD protection for micro-SD Card™; Ordered by: STM; Fitted: YES; ECCN_US/EU: EAR99/NEC; Manuf_1: STM; Manuf_Part_1: EMIF06-HSD03F3

## Sheet Arduino_Connectors.SchDoc: Arduino Connectors
size A4; Project: STM32H7-DK; Date: Not used; ApprovedBy: Not used; CheckedBy: Not used; Author: Not used; CompanyName: STMicroelectronics; DrawnBy: Not used; Engineer: Not used; Organization: Not used; Address1: Not used; Address2: Not used; Address3: Not used; Address4: Not used; DocumentNumber: Not used; Revision: Not used; SheetNumber: 14; SheetTotal: 16; CurrentTime: Not used; CurrentDate: Not used; Time: Not used; DocumentFullPathAndName: Not used; DocumentName: Not used; ModifiedDate: Not used; ImagePath: Not used; ProjectName: Not used; Application_BuildNumber: Not used
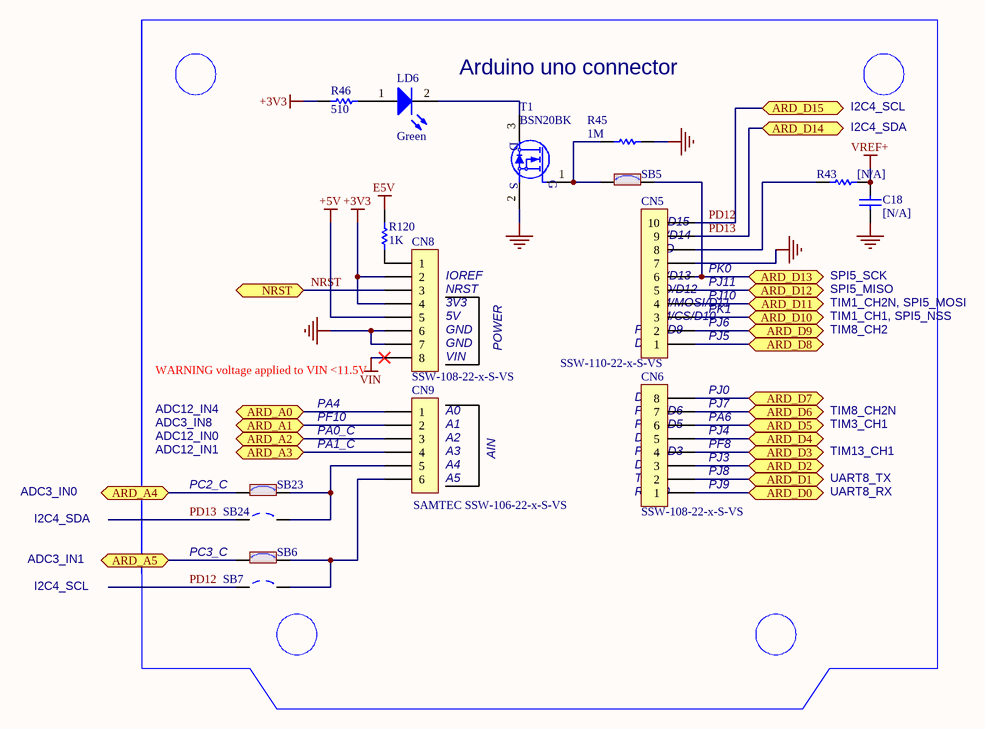
[diagram p8: Arduino_Connectors.SchDoc]

### Parts
C18  [N/A]  [0603C]
CN5  SSW-110-22-x-S-VS  [SSW-110-22-X-S-VS]
CN6  SSW-108-22-x-S-VS  [SSW-108-22-X-S-VS]
CN8  SSW-108-22-x-S-VS  [SSW-108-22-X-S-VS]
CN9  SAMTEC SSW-106-22-x-S-VS  [SSW-106-22-X-S-VS]
LD6  Green  [0603D]
R43  [N/A]  [0603R]
R45  1M  [0603R]
R46  510  [0603R]
R120  1K  [0603R]
SB5  Solder Bridge ON  [SB_0603]  (value not drawn)
SB6  Solder Bridge ON  [SB_0603]  (value not drawn)
SB7  Solder Bridge OFF  [SB_0603]  (value not drawn)
SB23  Solder Bridge ON  [SB_0603]  (value not drawn)
SB24  Solder Bridge OFF  [SB_0603]  (value not drawn)
T1  BSN20BK  [SOT-23]

### Ports
ARD_A0 (bidir), ARD_A1 (bidir), ARD_A2 (bidir), ARD_A3 (bidir), ARD_A4 (bidir), ARD_A5 (bidir), ARD_D0 (bidir), ARD_D1 (bidir), ARD_D2 (bidir), ARD_D3 (bidir), ARD_D4 (bidir), ARD_D5 (bidir), ARD_D6 (bidir), ARD_D7 (bidir), ARD_D8 (bidir), ARD_D9 (bidir), ARD_D10 (bidir), ARD_D11 (bidir), ARD_D12 (bidir), ARD_D13 (bidir), ARD_D14 (bidir), ARD_D15 (bidir), NRST (bidir)

### Nets
+3V3: CN8.2 CN8.4 R46.2
+5V: CN8.5
E5V: R120.1
GND: C18.1 CN5.7 CN8.6 CN8.7 R45.2 T1.2(S)
VIN: CN8.8
VREF+: C18.2 R43.2
NRST: CN8.3 ; port NRST
PA0_C: CN9.3 ; port ARD_A2
PA1_C: CN9.4 ; port ARD_A3
PA4: CN9.1 ; port ARD_A0
PC2_C: SB23.1 ; port ARD_A4
PC3_C: SB6.1 ; port ARD_A5
PD12: CN5.10 SB7.1 ; port ARD_D15
PD13: CN5.9 SB24.1 ; port ARD_D14
PF10: CN9.2 ; port ARD_A1
PJ0: CN6.8 ; port ARD_D7
PJ3: CN6.3 ; port ARD_D2
PJ4: CN6.5 ; port ARD_D4
PJ5: CN5.1 ; port ARD_D8
PJ6: CN5.2 ; port ARD_D9
PJ7: CN6.7 ; port ARD_D6
PJ8: CN6.2 ; port ARD_D1
PJ9: CN6.1 ; port ARD_D0
PJ10: CN5.4 ; port ARD_D11
PJ11: CN5.5 ; port ARD_D12
PK0: CN5.6 SB5.2 ; port ARD_D13
PK1: CN5.3 ; port ARD_D10
NetCN5_8: CN5.8 R43.1
NetCN6_4: CN6.4 ; port ARD_D3
NetCN6_6: CN6.6 ; port ARD_D5
NetCN8_1: CN8.1 R120.2
NetCN9_5: CN9.5 SB23.2 SB24.2
NetCN9_6: CN9.6 SB6.2 SB7.2
NetLD6_1: LD6.1(A) R46.1
NetLD6_2: LD6.2(K) T1.3(D)
NetR45_1: R45.1 SB5.1 T1.1(G)

### Notes on the sheet
- Arduino uno connector
- I2C4_SCL
- I2C4_SDA
- (near CN8) IOREF
- (near CN5) SDA/D14
- SCL/D15
- (near CN5) SCK/D13
- (near CN5) AVDD
- (near CN5) GND
- (near CN5) PK0
- SPI5_SCK
- (near CN8) NRST
- (near CN8) 3V3
- (near CN8) 5V
- (near CN8) GND
- (near CN5) PWM/D9
- (near CN5) PWM/CS/D10
- (near CN5) MISO/D12
- (near CN5) PWM/MOSI/D11
- (near CN5) PJ5
- (near CN5) PJ6
- (near CN5) PK1
- (near CN5) PJ10
- (near CN5) PJ11
- TIM8_CH2
- TIM1_CH1, SPI5_NSS
- TIM1_CH2N, SPI5_MOSI
- SPI5_MISO
- ADC12_IN4
- WARNING voltage applied to VIN <11.5V
- PA4
- (near CN9) A0
- (near CN8) VIN
- POWER
- (near CN6) PWM/D6
- (near CN6) D7
- (near CN5) D8
- (near CN6) PJ7
- PJ0
- TIM8_CH2N
- ADC12_IN1
- ADC12_IN0
- ADC3_IN8
- PF10
- PA0_C
- PA1_C
- (near CN9) A1
- (near CN9) A2
- (near CN9) A3
- (near CN9) A4
- AIN
- (near CN6) D2
- (near CN6) D4
- (near CN6) PWM/D3
- (near CN6) PWM/D5
- (near CN6) PJ8
- (near CN6) PJ3
- (near CN6) PJ4
- (near CN6) PA6
- (near CN6) PF8
- TIM13_CH1
- TIM3_CH1
- ADC3_IN0
- PC2_C
- (near CN9) A5
- (near CN6) RX/D0
- (near CN6) TX/D1
- (near CN6) PJ9
- UART8_RX
- UART8_TX
- ADC3_IN1
- PC3_C
- Title:
- Project:
- Size:
- Revision:
- Variant:
- -
- Date:
- Reference:
- Sheet:
- of

### Library data of the parts
C18 = Cap: Capacitor; Value: 10nF; Ordered by: Subcon; Fitted: NO; ECCN_US/EU: NA; Published: 8-Jun-2000; Revision: July-2002: Re-released for DXP Platform.; Publisher: Altium Limited
CN5 = Header 10X1_Female: Header, 10-Pin, Single row,female; Manuf_1: SAMTEC; Ordered by: Subcon; Silkscreen: pin names as in schematic; LatestRevisionDate: 17-Jul-2002; LatestRevisionNote: Re-released for DXP Platform.; Publisher: Altium Limited; Manuf_Part_1: SSW-110-22-x-S-VS
CN6 CN8 = Header 8X1_Female: Header, 8-Pin, Single row,female; Manuf_1: SAMTEC; Ordered by: Subcon; Silkscreen: pin names as in schematic; LatestRevisionDate: 17-Jul-2002; LatestRevisionNote: Re-released for DXP Platform.; Publisher: Altium Limited; Manuf_Part_1: SSW-108-22-x-S-VS
CN9 = Header 6X1_Female: Header, 6-Pin, Single row,female SMD; Ordered by: Subcon; Silkscreen: pin names as in schematic; LatestRevisionDate: 17-Jul-2002; LatestRevisionNote: Re-released for DXP Platform.; Publisher: Altium Limited; Manuf_1: SAMTEC; Manuf_Part_1: SSW-106-22-x-S-VS
LD6 = LED2: Typical RED, GREEN, YELLOW, AMBER GaAs LED; Ordered by: Subcon; ECCN_US/EU: EAR99/NEC; Published: 8-Jun-2000; Revision: July-2002: Re-released for DXP Platform.; Publisher: Altium Limited
R43 = res1: as R108 on sheet Audio; Published: 8-Jun-2000; Revision: July-2002: Re-released for DXP Platform.; Publisher: Altium Limited
R45 = res1: as R127 on sheet Audio; Published: 8-Jun-2000; Revision: July-2002: Re-released for DXP Platform.; Publisher: Altium Limited; Value: 1M
R46 = Res1: Resistor; Value: 1K; Ordered by: Subcon; ECCN_US/EU: NA; Published: 8-Jun-2000; Revision: July-2002: Re-released for DXP Platform.; Publisher: Altium Limited
R120 = res1: Resistor; Published: 8-Jun-2000; Revision: July-2002: Re-released for DXP Platform.; Publisher: Altium Limited; Value: 1K
SB5 SB6 SB23 = SB_ON: Fitted: YES; Ordered by: Subcon; Revision: July-2002: Re-released for DXP Platform.; ECCN_US/EU: n/a
SB7 SB24 = SB_OFF: Fitted: NO; Ordered by: Subcon; Revision: July-2002: Re-released for DXP Platform.; ECCN_US/EU: n/a
T1 = 2N7000: Manuf_1: NXP; Ordered by: Subcon; Manuf_Part_1: BSN20BK; ECCN_US/EU: N/A

## Sheet Power.SchDoc: Power
size A4; Project: STM32H7-DK; Date: Not used; ApprovedBy: Not used; CheckedBy: Not used; Author: Not used; CompanyName: STMicroelectronics; DrawnBy: Not used; Engineer: Not used; Organization: Not used; Address1: Not used; Address2: Not used; Address3: Not used; Address4: Not used; DocumentNumber: Not used; Revision: Not used; SheetNumber: 4; SheetTotal: 16; CurrentTime: Not used; CurrentDate: Not used; Time: Not used; DocumentFullPathAndName: Not used; DocumentName: Not used; ModifiedDate: Not used; ImagePath: Not used; ProjectName: Not used; Application_BuildNumber: Not used
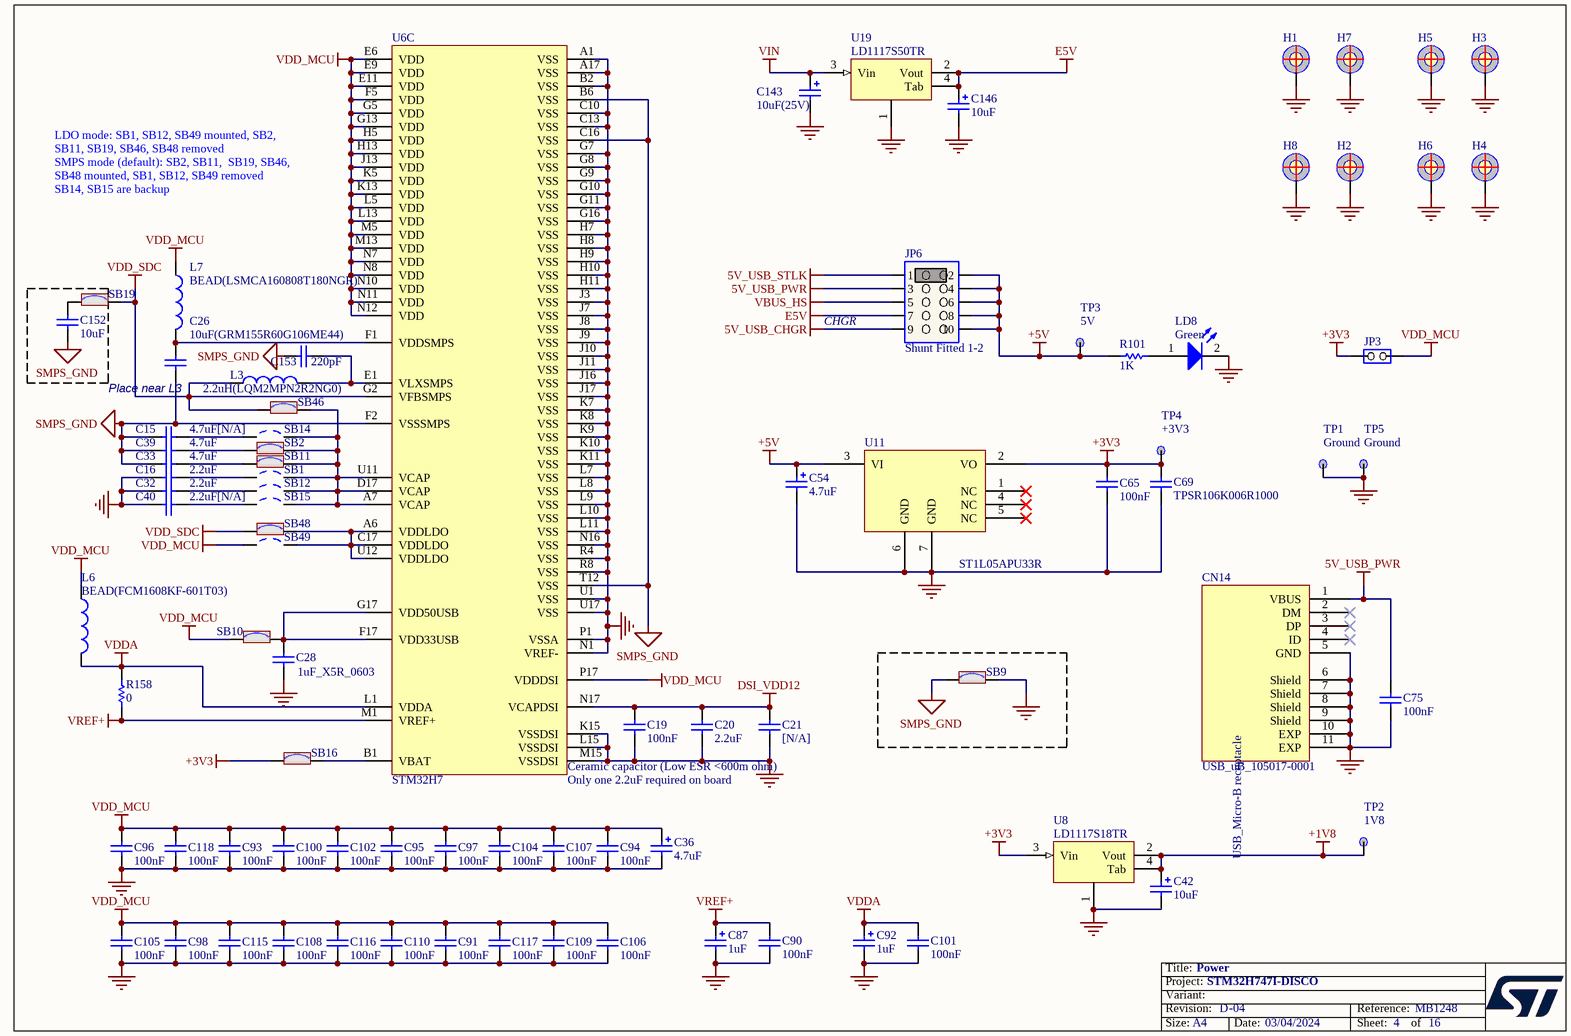
[diagram p9: Power.SchDoc]

### Parts
C15  4.7uF[N/A]  [0402C]
C16  2.2uF  [0603C]
C19  100nF  [0402C]
C20  2.2uF  [0603C]
C21  [N/A]  [1206C]
C26  10uF(GRM155R60G106ME44)  [0402C]
C28  1uF_X5R_0603  [0603C]
C32  2.2uF  [0603C]
C33  4.7uF  [0402C]
C36  4.7uF  [TAN-A]
C39  4.7uF  [0402C]
C40  2.2uF[N/A]  [0603C]
C42  10uF  [TAN-A]
C54  4.7uF  [TAN-A]
C65  100nF  [0603C]
C69  TPSR106K006R1000  [0805C]
C75  100nF  [0402C]
C87  1uF  [TAN-A]
C90  100nF  [0402C]
C91  100nF  [0402C]
C92  1uF  [TAN-A]
C93  100nF  [0402C]
C94  100nF  [0402C]
C95  100nF  [0402C]
C96  100nF  [0402C]
C97  100nF  [0402C]
C98  100nF  [0402C]
C100  100nF  [0402C]
C101  100nF  [0402C]
C102  100nF  [0402C]
C104  100nF  [0402C]
C105  100nF  [0402C]
C106  100nF  [0402C]
C107  100nF  [0402C]
C108  100nF  [0402C]
C109  100nF  [0402C]
C110  100nF  [0402C]
C115  100nF  [0402C]
C116  100nF  [0402C]
C117  100nF  [0402C]
C118  100nF  [0402C]
C143  10uF(25V)  [TAN-B]
C146  10uF  [TAN-A]
C152  10uF  [0603C]
C153  220pF  [0402C]
CN14  value USB_uB_105017-0001  [MICRO_USB_B_105017]  (hidden comment: USB_uB_105017.0001)
H1  POSITION HOLE C6D3R5  [HOLE_C7D3R5]  (value not drawn)
H2  POSITION HOLE C6D3R5  [HOLE_C7D3R5]  (value not drawn)
H3  POSITION HOLE C6D3R5  [HOLE_C9D4R5]  (value not drawn)
H4  POSITION HOLE C6D3R5  [HOLE_C9D4R5]  (value not drawn)
H5  POSITION HOLE C6D3R5  [HOLE_C9D4R5]  (value not drawn)
H6  POSITION HOLE C6D3R5  [HOLE_C9D4R5]  (value not drawn)
H7  POSITION HOLE C6D3R5  [HOLE_C7D3R5]  (value not drawn)
H8  POSITION HOLE C6D3R5  [HOLE_C7D3R5]  (value not drawn)
JP3  (no value)  [SIP2]
JP6  value Shunt Fitted 1-2  [HDR_2X5_2R54]  (hidden comment: Jumper_Header 5x2 Fitted 1-2)
L3  2.2uH(LQM2MPN2R2NG0)  [LSM2_VLS2016E_S]
L6  BEAD(FCM1608KF-601T03)  [0603L]
L7  BEAD(LSMCA160808T180NGR)  [0603L]
LD8  Green  [0603D]
R101  1K  [0603R]
R158  0  [0603R]
SB1  Solder Bridge OFF  [SB_0603]  (value not drawn)
SB2  Solder Bridge ON  [SB_0603]  (value not drawn)
SB9  Solder Bridge ON  [SB_0603]  (value not drawn)
SB10  Solder Bridge ON  [SB_0603]  (value not drawn)
SB11  Solder Bridge ON  [SB_0603]  (value not drawn)
SB12  Solder Bridge OFF  [SB_0603]  (value not drawn)
SB14  Solder Bridge OFF  [SB_0603]  (value not drawn)
SB15  Solder Bridge OFF  [SB_0603]  (value not drawn)
SB16  Solder Bridge ON  [SB_0603]  (value not drawn)
SB19  Solder Bridge ON  [SB_0603]  (value not drawn)
SB46  Solder Bridge ON  [SB_0603]  (value not drawn)
SB48  Solder Bridge ON  [SB_0603]  (value not drawn)
SB49  Solder Bridge OFF  [SB_0603]  (value not drawn)
TP1  Ground  [TP_C40]
TP2  1V8  [TP_C40]
TP3  5V  [TP_C40]
TP4  +3V3  [TP_C40]
TP5  Ground  [TP_C40]
U6  STM32H7  [BGA265_0R8_14X14_SKT]  (part C of 3)
U8  LD1117S18TR  [SOT-223]
U11  ST1L05APU33R  [DFN6_0R95_3X3]
U19  LD1117S50TR  [SOT-223]

### Nets
5V_USB_CHGR: JP6.9
5V_USB_PWR: C75.2 CN14.1(VBUS) JP6.3
5V_USB_STLK: JP6.1
+1V8: C42.1 TP2.1 U8.2(Vout) U8.4(Tab)
+3V3: C65.1 C69.2 JP3.1(COMMON) SB16.1 TP4.1 U8.3(Vin) U11.2(VO)
+5V: C54.1 JP6.2 JP6.4 JP6.6 JP6.8 JP6.10 R101.2 TP3.1 U11.3(VI)
DSI_VDD12: C19.1 C20.1 C21.2 U6.N17(VCAPDSI)
E5V: C146.1 JP6.7 U19.2(Vout) U19.4(Tab)
GND: C16.1 C19.2 C20.2 C21.1 C28.1 C32.1 C36.2 C40.1 C42.2 C54.2 C65.2 C69.1 C75.1 C87.2 C90.1 C91.2 C92.2 C93.2 C94.2 C95.2 C96.2 C97.2 C98.2 C100.2 C101.1 C102.2 C104.2 C105.2 C106.2 C107.2 C108.2 C109.2 C110.2 C115.2 C116.2 C117.2 C118.2 C143.2 C146.2 CN14.5(GND) CN14.6(Shield) CN14.7(Shield) CN14.8(Shield) CN14.9(Shield) CN14.10(EXP) CN14.11(EXP) H1.1 H2.1 H3.1 H4.1 H5.1 H6.1 H7.1 H8.1 LD8.2(K) SB9.2 TP1.1 TP5.1 U6.A1(VSS) U6.A17(VSS) U6.B2(VSS) U6.C10(VSS) U6.C13(VSS) U6.G7(VSS) U6.G8(VSS) U6.G9(VSS) U6.G10(VSS) U6.G11(VSS) U6.G16(VSS) U6.H7(VSS) U6.H8(VSS) U6.H9(VSS) U6.H10(VSS) U6.H11(VSS) U6.J3(VSS) U6.J7(VSS) U6.J8(VSS) U6.J9(VSS) U6.J10(VSS) U6.J11(VSS) U6.J16(VSS) U6.J17(VSS) U6.K7(VSS) U6.K8(VSS) U6.K9(VSS) U6.K10(VSS) U6.K11(VSS) U6.K15(VSSDSI) U6.L7(VSS) U6.L8(VSS) U6.L9(VSS) U6.L10(VSS) U6.L11(VSS) U6.L15(VSSDSI) U6.M15(VSSDSI) U6.N1(VREF-) U6.N16(VSS) U6.P1(VSSA) U6.R4(VSS) U6.R8(VSS) U6.U1(VSS) U6.U17(VSS) U8.1 U11.6(GND) U11.7(GND) U19.1
SMPS_GND: C15.1 C26.1 C33.1 C39.1 C152.1 C153.2 SB9.1 U6.B6(VSS) U6.C16(VSS) U6.F2(VSSSMPS) U6.T12(VSS)
VBUS_HS: JP6.5
VDD_MCU: C36.1 C91.1 C93.1 C94.1 C95.1 C96.1 C97.1 C98.1 C100.1 C102.1 C104.1 C105.1 C106.1 C107.1 C108.1 C109.1 C110.1 C115.1 C116.1 C117.1 C118.1 JP3.2(NO) L6.1 L7.1 SB10.1 SB49.1 U6.E6(VDD) U6.E9(VDD) U6.E11(VDD) U6.F5(VDD) U6.G5(VDD) U6.G13(VDD) U6.H5(VDD) U6.H13(VDD) U6.J13(VDD) U6.K5(VDD) U6.K13(VDD) U6.L5(VDD) U6.L13(VDD) U6.M5(VDD) U6.M13(VDD) U6.N7(VDD) U6.N8(VDD) U6.N10(VDD) U6.N11(VDD) U6.N12(VDD) U6.P17(VDDDSI)
VDD_SDC: L3.1 SB19.2 SB46.1 SB48.1 U6.G2(VFBSMPS)
VDDA: C92.1 C101.2 L6.2 R158.1 U6.L1(VDDA)
VIN: C143.1 U19.3(Vin)
VREF+: C87.1 C90.2 R158.2 U6.M1(VREF+)
NetC15_2: C15.2 SB14.1
NetC16_2: C16.2 SB1.1
NetC26_2: C26.2 L7.2 U6.F1(VDDSMPS)
NetC28_2: C28.2 SB10.2 U6.F17(VDD33USB) U6.G17(VDD50USB)
NetC32_2: C32.2 SB12.1
NetC33_2: C33.2 SB11.1
NetC39_2: C39.2 SB2.1
NetC40_2: C40.2 SB15.1
NetC152_2: C152.2 SB19.1
NetC153_1: C153.1 L3.2 U6.E1(VLXSMPS)
NetLD8_1: LD8.1(A) R101.1
NetSB1_2: SB1.2 SB2.2 SB11.2 SB12.2 SB14.2 SB15.2 SB46.2 U6.A7(VCAP) U6.D17(VCAP) U6.U11(VCAP)
NetSB16_2: SB16.2 U6.B1(VBAT)
NetSB48_2: SB48.2 SB49.2 U6.A6(VDDLDO) U6.C17(VDDLDO) U6.U12(VDDLDO)

Not connected (* = marked no-connect by the designer): CN14 2(DM)* 3(DP)* 4(ID)*; U11 1(NC)* 4(NC)* 5(NC)*

### Notes on the sheet
- LDO mode: SB1, SB12, SB49 mounted, SB2, SB11, SB19, SB46, SB48 removed
  SMPS mode (default): SB2, SB11,  SB19, SB46, SB48 mounted, SB1, SB12, SB49 removed
  SB14, SB15 are backup
- CHGR
- Place near L3
- (near U6) Ceramic capacitor (Low ESR <600m ohm)
- (near U6) Only one 2.2uF required on board
- Title:
- Project:
- Size:
- Revision:
- Variant:
- A4
- -
- Date:
- Reference:
- Sheet:
- of
- (in symbol MCD-00028) USB_Micro-B receptacle

### Library data of the parts
C15 = cap: as C151 on sheet Peripherals; Published: 8-Jun-2000; Revision: July-2002: Re-released for DXP Platform.; Publisher: Altium Limited
C16 C26 C32 C33 C39 C90 C101 C152 C153 = Cap: Capacitor; Value: 10nF; Published: 8-Jun-2000; Revision: July-2002: Re-released for DXP Platform.; Publisher: Altium Limited
C19 C91 C93-C98 C100 C102 C104-C110 C115-C118 = CAP: Capacitor; Published: 8-Jun-2000; Revision: July-2002: Re-released for DXP Platform.; Publisher: Altium Limited; Value: 100nF
C20 = CAP: Capacitor; Value: 100nF; Published: 8-Jun-2000; Revision: July-2002: Re-released for DXP Platform.; Publisher: Altium Limited
C21 = cap: Capacitor; Value: 2.2uF; Ordered by: Subcon; ECCN_US/EU: NA; Fitted: NO; Published: 8-Jun-2000; Revision: July-2002: Re-released for DXP Platform.; Publisher: Altium Limited
C28 = CAP SMD 0603  X5R 1礔 25V 10%: as C113 on sheet Ethernet; Manufacturer: *; Manufacturer P/N: *; Order code Farnell: 1288202RL; Value: 1礔; Power: *; Technology: X5R; Temperature  Factor: *; Temperature Max: +125癈; Temperature Min: -55癈; STS Code: *
C36 = Cap Pol1: Polarized Capacitor (Radial); Value: 47uF; Published: 8-Jun-2000; Revision: July-2002: Re-released for DXP Platform.; Publisher: Altium Limited
C40 = Cap: Capacitor; Value: 10nF; Fitted: NO; Published: 8-Jun-2000; Revision: July-2002: Re-released for DXP Platform.; Publisher: Altium Limited
C42 C146 = Cap_10uF_POL_10%_TANA: as C86 on sheet Ethernet; Revision: July-2002: Re-released for DXP Platform.; Value: 10uF; Manuf_1: VISHAY; Order: *; ECCN_US/EU: n/a
C54 = Cap Pol1: Polarized Capacitor (Radial); Value: 100pF; Ordered by: Subcon; ECCN_US/EU: NA; Published: 8-Jun-2000; Revision: July-2002: Re-released for DXP Platform.; Publisher: Altium Limited
C65 = Cap: Capacitor; Value: 10nF; Ordered by: Subcon; ECCN_US/EU: NA; Published: 8-Jun-2000; Revision: July-2002: Re-released for DXP Platform.; Publisher: Altium Limited
C69 = Cap: Capacitor; Manuf_1: AVX; Ordered by: Subcon; ECCN_US/EU: NA; Revision: V1.0; Manuf_Part_1: TPSR106K006R1000; Value: TPSR106K006R1000
C75 = MCD-00016: Capacitor,20pF,50V,NPO,5%,0402; Manufacturer_Part_Number: CC0402JRNPO9BN200; Manufacturer: YAGEO; Provided_By: Subcon; Initial_Board_Reference: mb1274; Internal_Part_Number: MCD-00016; Value: 100nF; Status: Released; Package: 0402; ComponentLink1Description: Yageo_Capacitor_NP0_16V-to-50V.pdf; ECCN_US: n/a; ECCN_EU: n/a; Part_Type: Capacitor
C87 C92 = Cap Pol1: Polarized Capacitor (Radial); Value: 10uF; Published: 8-Jun-2000; Revision: July-2002: Re-released for DXP Platform.; Publisher: Altium Limited
C143 = Cap Pol1: Polarized Capacitor (Radial); Published: 8-Jun-2000; Revision: July-2002: Re-released for DXP Platform.; Publisher: Altium Limited; Value: 10uF
CN14 = MCD-00028: USB-MICRO-B, 0.65mm, RA, SMT, Bottom Mount,; Manufacturer_Part_Number: 1050170001; Manufacturer: MOLEX; Part_Type: Connector; Provided_By: Subcon; Initial_Board_Reference: mb1274; Internal_Part_Number: MCD-00028; Status: Released; ComponentLink1Description: Molex_Connector-USB-uB_1050170001.pdf; ECCN_US: n/a; ECCN_EU: n/a
H1-H8 = POSITION HOLE C6D3R5: Fitted: NO
JP3 = JP2
JP6 = MCD-01203: Header, 5x2, 2,54mm, VR, TH, Height 5.84mm/2.54mm - Shunt Fitted 1-2; Part_Type: Connector; Manufacturer_Part_Number: TSW-105-07-x-D; Manufacturer: SAMTEC; Provided_By: Subcon; Initial_Board_Reference: Mb1372; Internal_Part_Number: MCD-01203; Status: Symbol available; ComponentLink1Description: Samtec_TSW-HTSW-series.pdf; ComponentLink1URL: http://tunmcdsvn.tun.st.com/Component_Datasheet_Library/Trunk/Connectors/Samtec_TSW-HTSW-series; ECCN_US: n/a; ECCN_EU: n/a
L3 L6 L7 = Inductor: Value: 100uH; Published: 8-Jun-2000; Revision: July-2002: Re-released for DXP Platform.; Publisher: Altium Limited
  L7: MPN: LSMCA160808T180NGR
LD8 = LED2: as LD1 on sheet Peripherals; Published: 8-Jun-2000; Revision: July-2002: Re-released for DXP Platform.; Publisher: Altium Limited
R101 = res1: Resistor; Published: 8-Jun-2000; Revision: July-2002: Re-released for DXP Platform.; Publisher: Altium Limited; Value: 1K
R158 = Res1: Resistor; Value: 1K; Published: 8-Jun-2000; Revision: July-2002: Re-released for DXP Platform.; Publisher: Altium Limited
SB1 SB12 SB14 SB15 SB49 = SB_OFF: Fitted: NO; Ordered by: Subcon; Revision: July-2002: Re-released for DXP Platform.; ECCN_US/EU: n/a
SB2 SB9-SB11 SB16 SB19 SB46 SB48 = SB_ON: Fitted: YES; Ordered by: Subcon; Revision: July-2002: Re-released for DXP Platform.; ECCN_US/EU: n/a
TP1-TP5 = TP
U6 = STM32H7_TFBGA265
U8 U19 = LD1117: Ordered by: STM; ECCN_US/EU: EAR99/NEC; Fitted: YES; Manuf_1: STM
  U8: Manuf_Part_1: LD1117S18TR
  U19: Manuf_Part_1: LD1117S50TR
U11 = ST1L05A: Ordered by: STM; ECCN_US/EU: EAR99/NEC; Fitted: YES; Manuf_1: STM; Manuf_Part_1: ST1L05APU33R

## Sheet USB_OTG .SchDoc: USB OTG HS
size A4; Project: STM32H7-DK; Date: Not used; ApprovedBy: Not used; CheckedBy: Not used; Author: Not used; CompanyName: STMicroelectronics; DrawnBy: Not used; Engineer: Not used; Organization: Not used; Address1: Not used; Address2: Not used; Address3: Not used; Address4: Not used; DocumentNumber: Not used; Revision: Not used; SheetNumber: 15; SheetTotal: 16; CurrentTime: Not used; CurrentDate: Not used; Time: Not used; DocumentFullPathAndName: Not used; DocumentName: Not used; ModifiedDate: Not used; ImagePath: Not used; ProjectName: Not used; Application_BuildNumber: Not used
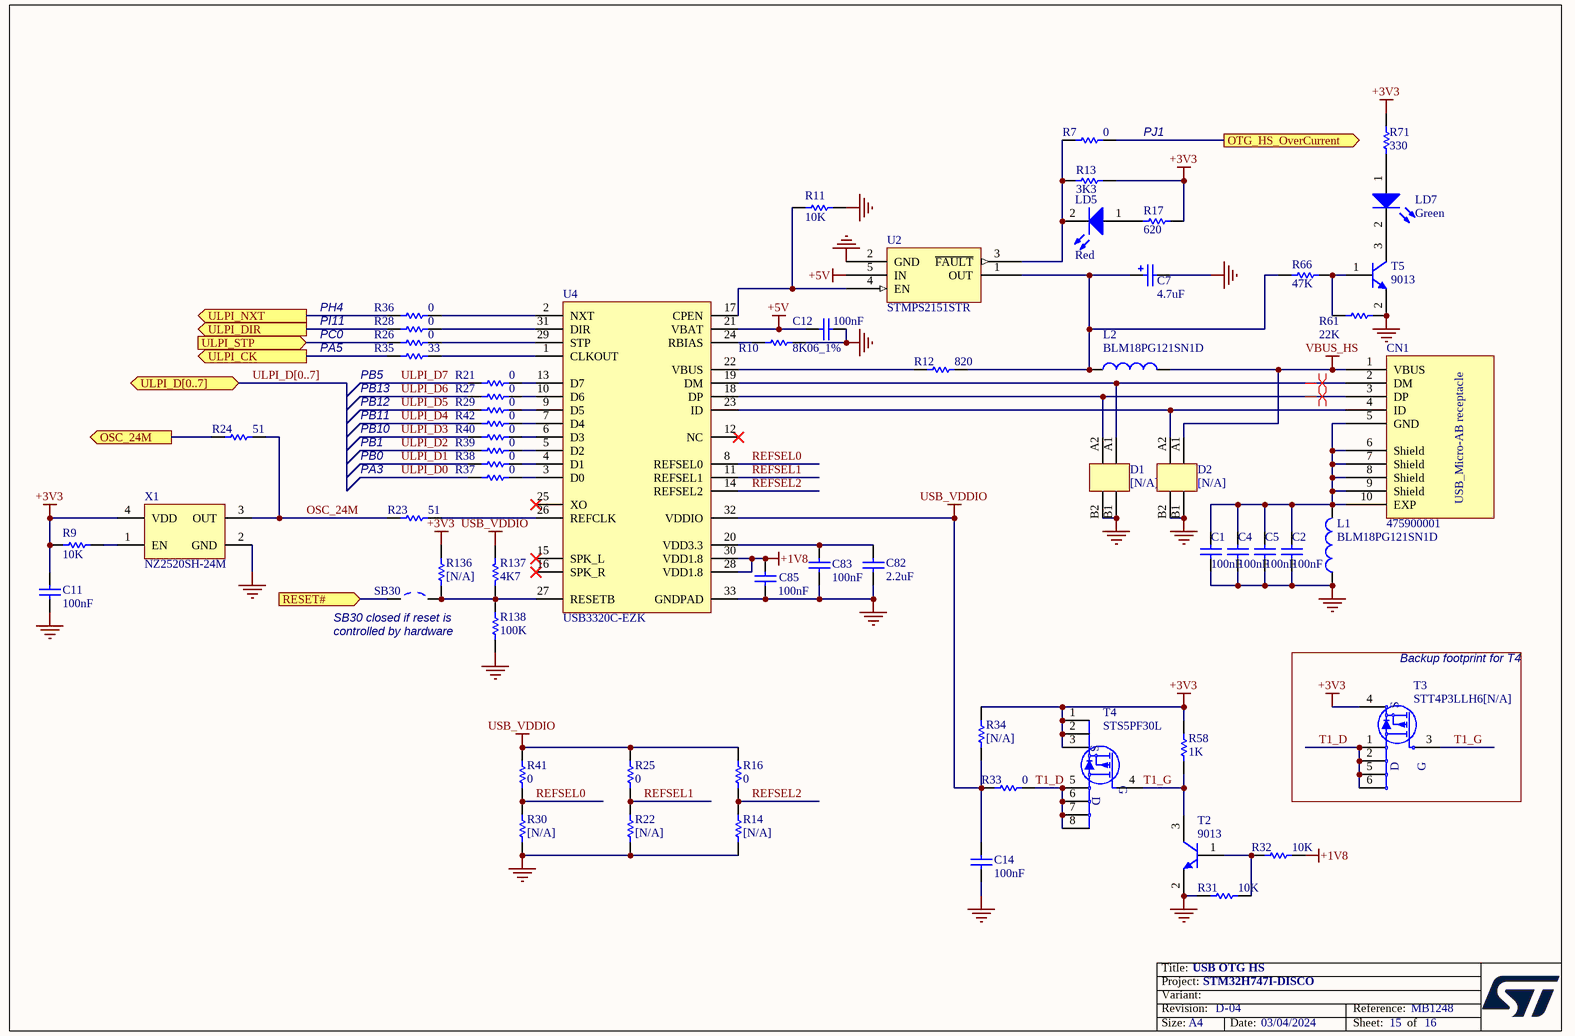
[diagram p10: USB_OTG .SchDoc]

### Parts
C1  100nF  [0603C]
C2  100nF  [0603C]
C4  100nF  [0603C]
C5  100nF  [0603C]
C7  4.7uF  [TAN-A]
C11  100nF  [0603C]
C12  100nF  [0603C]
C14  100nF  [0603C]
C82  2.2uF  [1206C]
C83  100nF  [0603C]
C85  100nF  [0603C]
CN1  475900001  [MOLEX_47590001]
D1  [N/A]  [BGA4_0R4_1X1]
D2  [N/A]  [BGA4_0R4_0R8X0R8]
L1  BLM18PG121SN1D  [0603L]
L2  BLM18PG121SN1D  [0603L]
LD5  Red  [0603D]
LD7  Green  [0603D]
R7  0  [0603R]
R9  10K  [0603R]
R10  8K06_1%  [0603R]
R11  10K  [0603R]
R12  820  [0603R]
R13  3K3  [0603R]
R14  [N/A]  [0603R]
R16  0  [0603R]
R17  620  [0603R]
R21  0  [0603R]
R22  [N/A]  [0603R]
R23  51  [0603R]
R24  51  [0603R]
R25  0  [0603R]
R26  0  [0603R]
R27  0  [0603R]
R28  0  [0603R]
R29  0  [0603R]
R30  [N/A]  [0603R]
R31  10K  [0603R]
R32  10K  [0603R]
R33  0  [0603R]
R34  [N/A]  [0603R]
R35  33  [0603R]
R36  0  [0603R]
R37  0  [0603R]
R38  0  [0603R]
R39  0  [0603R]
R40  0  [0603R]
R41  0  [0603R]
R42  0  [0603R]
R58  1K  [0603R]
R61  22K  [0603R]
R66  47K  [0603R]
R71  330  [0603R]
R136  [N/A]  [0603R]
R137  4K7  [0603R]
R138  100K  [0603R]
SB30  Solder Bridge OFF  [SB_0603]  (value not drawn)
T2  9013  [SOT-23]
T3  STT4P3LLH6[N/A]  [SOT23-6L]
T4  STS5PF30L  [SOIC8_1R27_4R9X6]
T5  9013  [SOT-23]
U2  STMPS2151STR  [SOT23-5]
U4  USB3320C-EZK  [QFN32_0R5_5X5]
X1  NZ2520SH-24M  [OSC_4SM_2R5X2]

### Blocks framed on the sheet
Backup footprint for T4: T3

### Ports
OSC_24M (out), OTG_HS_OverCurrent (out), RESET# (in), ULPI_CK (out), ULPI_D[0..7] (bidir), ULPI_DIR (out), ULPI_NXT (out), ULPI_STP (in)

### Nets
+1V8: C85.1 R32.1 U4.28(VDD1.8) U4.30(VDD1.8)
+3V3: C11.2 R9.1 R13.1 R17.2 R34.1 R58.2 R71.2 R136.2 T3.4(S) T4.1(S) T4.2(S) T4.3(S) X1.4(VDD)
+5V: C12.1 U2.5(IN) U4.21(VBAT)
GND: C1.2 C2.2 C4.2 C5.2 C7.2 C11.1 C12.2 C14.2 C82.1 C83.2 C85.2 D1.B1 D1.B2 D2.B1 D2.B2 L1.1 R10.2 R11.1 R14.2 R22.2 R30.2 R31.2 R61.1 R138.1 T2.2(E) T5.2(E) U2.2(GND) U4.33(GNDPAD) X1.2(GND)
USB_VDDIO: C14.1 R16.2 R25.2 R33.2 R34.2 R41.2 R137.2 U4.32(VDDIO)
VBUS_HS: CN1.1(VBUS) D2.A1 L2.2
Camera_CLK: R24.2 ; port OSC_24M
OSC_24M: R23.2 R24.1 X1.3(OUT)
PA5: R35.2 ; port ULPI_CK
PC0: R26.2 ; port ULPI_STP
PH4: R36.2 ; port ULPI_NXT
PI11: R28.2 ; port ULPI_DIR
PJ1: R7.1 ; port OTG_HS_OverCurrent
REFSEL0: R30.1 R41.1 U4.8(REFSEL0)
REFSEL1: R22.1 R25.1 U4.11(REFSEL1)
REFSEL2: R14.1 R16.1 U4.14(REFSEL2)
T1_D: R33.1 T3.1(S) T3.2(S) T3.5(D) T3.6(D) T4.5(D) T4.6(D) T4.7(D) T4.8(D)
T1_G: R58.1 T2.3(C) T3.3(G) T4.4(G)
ULPI_D0: R37.2  [project net PA3]
ULPI_D1: R38.2  [project net PB0]
ULPI_D2: R39.2  [project net PB1]
ULPI_D3: R40.2  [project net PB10]
ULPI_D4: R42.2  [project net PB11]
ULPI_D5: R29.2  [project net PB12]
ULPI_D6: R27.2  [project net PB13]
ULPI_D7: R21.2  [project net PB5]
NetB1_2: SB30.1 ; port RESET#
NetC1_1: C1.1 C2.1 C4.1 C5.1 CN1.5(GND) CN1.6(Shield) CN1.7(Shield) CN1.8(Shield) CN1.9(Shield) CN1.10(EXP) L1.2
NetC7_1: C7.1 L2.1 R12.2 R66.2 U2.1(OUT)
NetC82_2: C82.2 C83.1 U4.20(VDD3.3)
NetCN1_2: CN1.2(DM) D1.A1 U4.19(DM)
NetCN1_3: CN1.3(DP) D1.A2 U4.18(DP)
NetCN1_4: CN1.4(ID) D2.A2 U4.23(ID)
NetLD5_1: LD5.1(A) R17.1
NetLD5_2: LD5.2(K) R7.2 R13.2 U2.3(~{FAULT})
NetLD7_1: LD7.1(A) R71.1
NetLD7_2: LD7.2(K) T5.3(C)
NetR9_2: R9.2 X1.1(EN)
NetR10_1: R10.1 U4.24(RBIAS)
NetR11_2: R11.2 U2.4(EN) U4.17(CPEN)
NetR12_1: R12.1 U4.22(VBUS)
NetR21_1: R21.1 U4.13(D7)
NetR23_1: R23.1 U4.26(REFCLK)
NetR26_1: R26.1 U4.29(STP)
NetR27_1: R27.1 U4.10(D6)
NetR28_1: R28.1 U4.31(DIR)
NetR29_1: R29.1 U4.9(D5)
NetR31_1: R31.1 R32.2 T2.1(B)
NetR35_1: R35.1 U4.1(CLKOUT)
NetR36_1: R36.1 U4.2(NXT)
NetR37_1: R37.1 U4.3(D0)
NetR38_1: R38.1 U4.4(D1)
NetR39_1: R39.1 U4.5(D2)
NetR40_1: R40.1 U4.6(D3)
NetR42_1: R42.1 U4.7(D4)
NetR61_2: R61.2 R66.1 T5.1(B)
NetR136_1: R136.1 R137.1 R138.2 SB30.2 U4.27(RESETB)

Not connected (* = marked no-connect by the designer): U4 12(NC)* 15(SPK_L)* 16(SPK_R)* 25(XO)*

### Buses and harness runs
bus ULPI_D[0..7] = port ULPI_D[0..7]

### Layout directives
differential pair: NetCN1_2, NetCN1_3

### Notes on the sheet
- PJ1
- PH4
- PI11
- PC0
- PA5
- PB5
- PB1
- PB10
- PB11
- PB12
- PB13
- (near R23) PA3
- PB0
- SB30 closed if reset is
- controlled by hardware
- Title:
- Project:
- Size:
- Revision:
- Variant:
- A4
- -
- Date:
- Reference:
- Sheet:
- of
- (in symbol 475900001) USB_Micro-AB receptacle

### Library data of the parts
C1 C2 C4 C5 C12 C14 C83 C85 = Cap: Capacitor; Value: 10nF; Published: 8-Jun-2000; Revision: July-2002: Re-released for DXP Platform.; Publisher: Altium Limited
C7 = Cap Pol1: as C36 on sheet Power; Published: 8-Jun-2000; Revision: July-2002: Re-released for DXP Platform.; Publisher: Altium Limited
C11 = CAP: Capacitor; Published: 8-Jun-2000; Revision: July-2002: Re-released for DXP Platform.; Publisher: Altium Limited; Value: 100nF
C82 = MCD-00008: Capacitor,2.2uF,16V, X7R,10%,1206; Manufacturer_Part_Number: CC1206KKX7R7BB225; Manufacturer: YAGEO; Alternate_Manufacturer_Part_Number: C1206C225K4RAC; Alternate_Manufacturer: KEMET; Provided_By: Subcon; Initial_Board_Reference: mb1274; Internal_Part_Number: MCD-00008; Value: 2.2uF; Status: Released; Package: 1206; ComponentLink1Description: Yageo_Capacitor_X7R-series.pdf; ECCN_US: n/a; ECCN_EU: n/a; Part_Type: Capacitor
CN1 = 475900001: Manuf_1: MOLEX; Fitted: YES; Ordered by: Subcon; ECCN_US/EU: EAR99/NEC; Manuf_Part_1: 475900001
D1 = USBULC6-2F3: Fitted: NO; Ordered by: STM; ECCN_US/EU: EAR99/NEC; Manuf_1: STM; Manuf_Part_1: USBULC6-2F3
D2 = ESDA14V2-2BF3: Fitted: NO; Ordered by: STM; ECCN_US/EU: EAR99/NEC; Manuf_1: STM; Manuf_Part_1: ESDA14V2-2BF3
L1 L2 = BEAD_120R_2A_0603: Bead,120R,2A,0603,BLM18PG121SN1D,MURATA; Manuf_Part_3: FCM1608KF-601T03; Manuf_2: TDK; Manuf_Part_2: MPZ1608S300A; Manuf_3: Tai-tech; Value: 100uH; Description_3: Bead,600R,350mA,0603,FCM1608KF-601T03,Tai-tech; Description_2: Bead,30R,5A,0603,MPZ1608S300A,TDK; Revision: July-2002: Re-released for DXP Platform.; ECCN_US/EU: n/a; Manuf_Part_1: BLM18PG121SN1D; Manuf_1: MURATA
LD5 LD7 = LED2: as LD1 on sheet Peripherals; Published: 8-Jun-2000; Revision: July-2002: Re-released for DXP Platform.; Publisher: Altium Limited
R7 R16 R17 R21 R23-R29 R33 R35-R42 R137 = Res1: Resistor; Value: 1K; Published: 8-Jun-2000; Revision: July-2002: Re-released for DXP Platform.; Publisher: Altium Limited
R9 = Res_10K_1%_0402: Resistor,10K,0402,1%,YAGEO; Value: 10K; Manuf_1: YAGEO; ECCN_US/EU: n/a
R10 = Res_8K06_1%_0402: Resistor,8K06,0402,1%,YAGEO; Value: 8K06; Manuf_1: YAGEO; ECCN_US/EU: n/a; Distrib: DIGIKEY
R11-R13 R31 R32 R61 R66 R71 = res1: Resistor; Value: 1K; Published: 8-Jun-2000; Revision: July-2002: Re-released for DXP Platform.; Publisher: Altium Limited
R14 R22 R30 R34 R136 = res1: as R108 on sheet Audio; Published: 8-Jun-2000; Revision: July-2002: Re-released for DXP Platform.; Publisher: Altium Limited
R58 = res1: Resistor; Published: 8-Jun-2000; Revision: July-2002: Re-released for DXP Platform.; Publisher: Altium Limited; Value: 1K
R138 = Resistor_ST: Resistor 0402 / 0603 / 0805; Value: 10K
SB30 = SB_OFF: Fitted: NO; Ordered by: Subcon; Revision: July-2002: Re-released for DXP Platform.; ECCN_US/EU: n/a
T2 T5 = NPN: NPN Bipolar Transistor; Code - JEDEC: TO-226-AA; Published: 8-Jun-2000; Revision: July-2002: Re-released for DXP Platform.; Publisher: Altium Limited
T3 = STT7P2UH7: STripFET VII DeepGATE Power MOSFET, P-CHANNEL 20 V, 0.0146, 7 A - SOT23-6L; Manuf_1: STM; Fitted: NO; Ref St: xxxxxxxx; ECCN_US/EU: EAR99/NEC; Comments: exclusive with T4; Manuf_Part_1: STT4P3LLH6; Order: STT4P3LLH6; Distrib: ST; Ordered by: STM
T4 = STS7PF30L
U2 = STMPS2141STR: Fitted: YES; Ordered by: STM; ECCN_US/EU: EAR99/NEC; Manuf_1: STM; Manuf_Part_1: STMPS2151STR
U4 = USB3320C-EZK: USB3320C,  Hi-Speed USB Host, Device or OTG PHY with ULPI Low Pin Interface; Manuf_1: MICROCHIP; Manuf_Part_1: USB3320C-EZK-TR; Fitted: YES; Ordered by: Subcon; ECCN_US/EU: EAR99/NEC
X1 = OSC_24M_NZ2520SB: Oscillator 24.00Mhz, -+50PPM, 3.3V, Temp -55 to +125癈; Manuf_Part_1: NZ2520SB 24MHz END4869A; Manuf_1: NDK; Manuf_Part_2: KC2520B24.0000C10E00; Manuf_2: AVX Corp/Kyocera Corp; Ordered by: STM; ECCN_US/EU: EAR99/NEC; Ref St: 9157032; Fitted: YES